# Altium schematic sheet Teensy4-CANTool-Rev2.SchDoc: Teensy 4 CAN Tool
size Letter portrait; DrawnBy: J Daily; Revision: 2; SheetNumber: 1; SheetTotal: 1
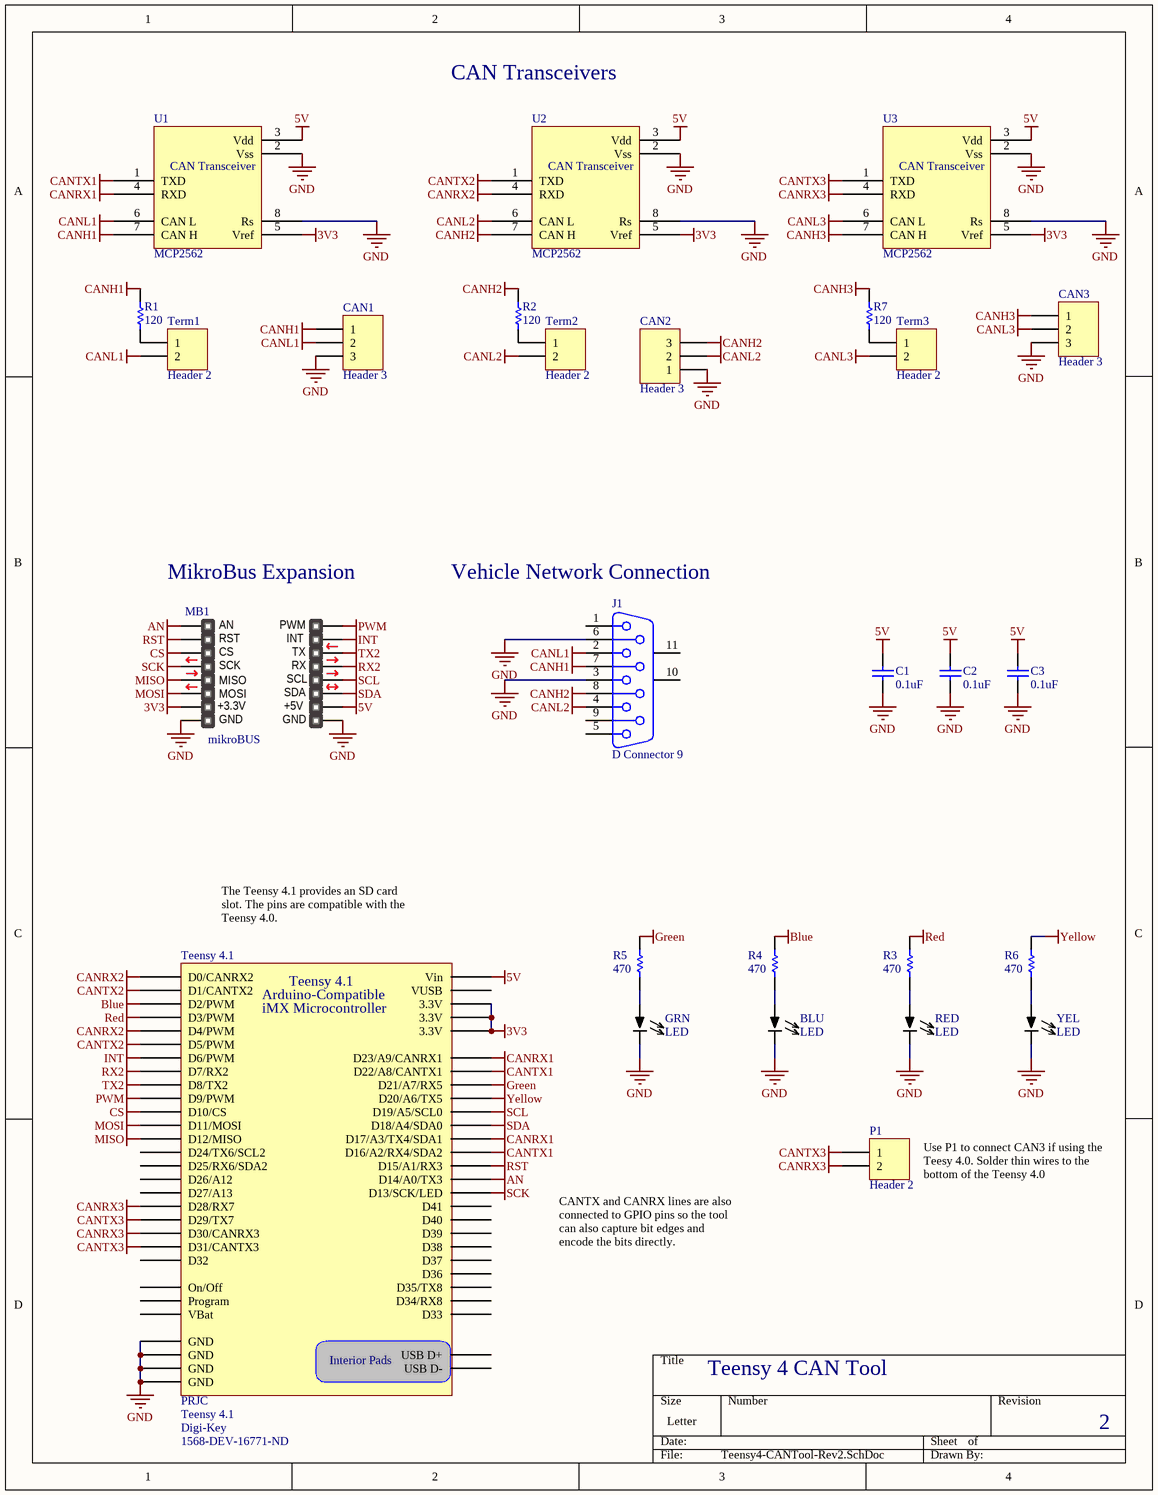
[diagram p0: Teensy4-CANTool-Rev2.SchDoc]

## Parts
BLU  LED  [LED - 5mm Through Hole]
C1  0.1uF  [CAPR5-4X5]
C2  0.1uF  [CAPR5-4X5]
C3  0.1uF  [CAPR5-4X5]
CAN1  Header 3  [PCB Terminal Block - 3]
CAN2  Header 3  [PCB Terminal Block - 3]
CAN3  Header 3  [PCB Terminal Block - 3]
GRN  LED  [LED - 5mm Through Hole]
J1  D Connector 9  [DSUB1.385-2H9]
MB1  mikroBUS  [mikroBUS - Midi]  (no BOM)
P1  Header 2  [HDR1X2]
R1  120  [AXIAL-0.4]
R2  120  [AXIAL-0.4]
R3  470  [AXIAL-0.4]
R4  470  [AXIAL-0.4]
R5  470  [AXIAL-0.4]
R6  470  [AXIAL-0.4]
R7  120  [AXIAL-0.4]
RED  LED  [LED - 5mm Through Hole]
Teensy_4.1  Manufacturer: PRJC  Supplier 1: Digi-Key  Supplier Part Number 1: 1568-DEV-16771-ND  [Teensy 4.1]  (hidden comment: Teensy 4.1)
Term1  Header 2  [HDR1X2]
Term2  Header 2  [HDR1X2]
Term3  Header 2  [HDR1X2]
U1  MCP2562  [DIP8]
U2  MCP2562  [DIP8]
U3  MCP2562  [DIP8]
YEL  LED  [LED - 5mm Through Hole]

## Nets
3V3: MB1.7(3.3V) Teensy_4.1.3V3a(3.3V) Teensy_4.1.3V3b(3.3V) Teensy_4.1.3V3c(3.3V) U1.5(Vref) U2.5(Vref) U3.5(Vref)
5V: C1.2 C2.2 C3.2 MB1.10(5V) Teensy_4.1.Vin U1.3(Vdd) U2.3(Vdd) U3.3(Vdd)
AN: MB1.1(AN) Teensy_4.1.14(D14/A0/TX3)
Blue: R4.2 Teensy_4.1.2(D2/PWM)
CANH1: CAN1.1 J1.7 R1.1 U1.7(CAN_H)
CANH2: CAN2.3 J1.8 R2.1 U2.7(CAN_H)
CANH3: CAN3.1 R7.1 U3.7(CAN_H)
CANL1: CAN1.2 J1.2 Term1.2 U1.6(CAN_L)
CANL2: CAN2.2 J1.4 Term2.2 U2.6(CAN_L)
CANL3: CAN3.2 Term3.2 U3.6(CAN_L)
CANRX1: Teensy_4.1.17(D17/A3/TX4/SDA1) Teensy_4.1.23(D23/A9/CANRX1) U1.4(RXD)
CANRX2: Teensy_4.1.0(D0/CANRX2) Teensy_4.1.4(D4/PWM) U2.4(RXD)
CANRX3: P1.2 Teensy_4.1.28(D28/RX7) Teensy_4.1.30(D30/CANRX3) U3.4(RXD)
CANTX1: Teensy_4.1.16(D16/A2/RX4/SDA2) Teensy_4.1.22(D22/A8/CANTX1) U1.1(TXD)
CANTX2: Teensy_4.1.1(D1/CANTX2) Teensy_4.1.5(D5/PWM) U2.1(TXD)
CANTX3: P1.1 Teensy_4.1.29(D29/TX7) Teensy_4.1.31(D31/CANTX3) U3.1(TXD)
CS: MB1.3(CS) Teensy_4.1.10(D10/CS)
GND: BLU.2(C) C1.1 C2.1 C3.1 CAN1.3 CAN2.1 CAN3.3 GRN.2(C) J1.3 J1.6 MB1.8(GND) MB1.9(GND) RED.2(C) Teensy_4.1.G1(GND) Teensy_4.1.G2(GND) Teensy_4.1.G3(GND) Teensy_4.1.G4(GND) U1.2(Vss) U1.8(Rs) U2.2(Vss) U2.8(Rs) U3.2(Vss) U3.8(Rs) YEL.2(C)
Green: R5.2 Teensy_4.1.21(D21/A7/RX5)
INT: MB1.15(INT) Teensy_4.1.6(D6/PWM)
MISO: MB1.5(MISO) Teensy_4.1.12(D12/MISO)
MOSI: MB1.6(MOSI) Teensy_4.1.11(D11/MOSI)
PWM: MB1.16(PWM) Teensy_4.1.9(D9/PWM)
Red: R3.2 Teensy_4.1.3(D3/PWM)
RST: MB1.2(RST) Teensy_4.1.15(D15/A1/RX3)
RX2: MB1.13(TX) Teensy_4.1.7(D7/RX2)
SCK: MB1.4(SCK) Teensy_4.1.13(D13/SCK/LED)
SCL: MB1.12(SCL) Teensy_4.1.19(D19/A5/SCL0)
SDA: MB1.11(SDA) Teensy_4.1.18(D18/A4/SDA0)
TX2: MB1.14(RX) Teensy_4.1.8(D8/TX2)
Yellow: R6.2 Teensy_4.1.20(D20/A6/TX5)
NetBLU_1: BLU.1(A) R4.1
NetGRN_1: GRN.1(A) R5.1
NetR1_2: R1.2 Term1.1
NetR2_2: R2.2 Term2.1
NetR3_1: R3.1 RED.1(A)
NetR6_1: R6.1 YEL.1(A)
NetR7_2: R7.2 Term3.1

Not connected (* = marked no-connect by the designer): J1 1 5 9 10(MH1) 11(MH2); Teensy_4.1 24(D24/TX6/SCL2) 25(D25/RX6/SDA2) 26(D26/A12) 27(D27/A13) 32(D32) 33(D33) 34(D34/RX8) 35(D35/TX8) 36(D36) 37(D37) 38(D38) 39(D39) 40(D40) 41(D41) D+(USB_D+) D-(USB_D-) On(On/Off) P(Program) VBat VUSB

## Notes on the sheet
- CAN Transceivers
- (near MB1) MikroBus Expansion
- (near J1) Vehicle Network Connection
- (near Teensy_4.1) The Teensy 4.1 provides an SD card slot. The pins are compatible with the Teensy 4.0.
- Use P1 to connect CAN3 if using the Teesy 4.0. Solder thin wires to the bottom of the Teensy 4.0
- CANTX and CANRX lines are also connected to GPIO pins so the tool can also capture bit edges and encode the bits directly.
- (in symbol MCP2551) CAN Transceiver
- (in symbol mikroBUS compatible add-on board) +3.3V; +5V
- (in symbol Teensy 4.1) Arduino-Compatible; iMX Microcontroller; Interior Pads

## Library data of the parts
BLU = LED: Blue 470nm LED Indication - Discrete 3.2V Radial; Manufacturer: Würth Elektronik; PartNumber: 151051BS04000; Supplier 1: Digi-Key; Supplier Part Number 1: 732-5015-ND
C1-C3 = Cap: 0.1µF ±10% 50V Ceramic Capacitor X7R 0603 (1608 Metric); Manufacturer: Vishay Beyschlag/Draloric/BC Components; PartNumber: K104K15X7RF53H5; Supplier 1: Digi-Key; Supplier Part Number 1: BC3323-ND
CAN1-CAN3 = Header 3: Header, 3-Pin; Manufacturer: Phoenix Contact; PartNumber: 1935174; Supplier 1: Digi-Key; Supplier Part Number 1: 277-1578-ND
GRN = LED: Green 572nm LED Indication - Discrete 2.1V Radial; Manufacturer: Würth Elektronik; PartNumber: 151051VS04000; Supplier 1: Digi-Key; Supplier Part Number 1: 732-5017-ND
J1 = D Connector 9: CONN D-SUB PLUG 9POS R/A SLDR; Manufacturer: Assmann WSW Components; PartNumber: A-DS 09 A/KG-T2S; Supplier 1: Digi-Key; Supplier Part Number 1: AE10968-ND
MB1 = mikroBUS compatible add-on board
P1 = Header 2: Header, 2-Pin
R1 R2 R7 = Res1: 120 Ohms ±5% 0.25W, 1/4W Through Hole Resistor Axial Carbon Film; Manufacturer: YAGEO; PartNumber: CFR-25JB-52-120R; Supplier 1: Digi-Key; Supplier Part Number 1: 120QBK-ND
R3-R6 = Res1: 470 Ohms ±5% 0.25W, 1/4W Through Hole Resistor Axial Carbon Film; Manufacturer: YAGEO; PartNumber: CFR-25JB-52-470R; Supplier 1: Digi-Key; Supplier Part Number 1: 470QBK-ND
RED = LED: Red 645nm LED Indication - Discrete 2.1V Radial; Manufacturer: Würth Elektronik; PartNumber: 151051RS11000; Supplier 1: Digi-Key; Supplier Part Number 1: 732-5016-ND
Teensy_4.1 = Teensy 4.1: 32 Bit Arduino-Compatible iMX Microcontroller; PartNumber: Teensy 4.1
Term1-Term3 = Header 2: 2 (1 x 2) Position Shunt Connector Open Top, Grip 0.100" (2.54mm) Gold; Manufacturer: Sullins Connector Solutions; PartNumber: NPC02SXON-RC; Supplier 1: Digi-Key; Supplier Part Number 1: S9341-ND
U1-U3 = MCP2551: 1/1 Transceiver CANbus 8-PDIP; Manufacturer: Microchip Technology; PartNumber: MCP2562FD-E/P; Supplier 1: Digi-Key; Supplier Part Number 1: MCP2562FD-E/P-ND
YEL = LED: Yellow 590nm LED Indication - Discrete 2V Radial; Manufacturer: Würth Elektronik; PartNumber: 151051YS04000; Supplier 1: Digi-Key; Supplier Part Number 1: 732-5018-ND